# EasyEDA schematic SCH_RPi5-GPIO-Breakout-Board-(AI-Capsule)_2026-08-20.json

## Sheets
1 SCH_Breakout Board (ReSpeaker): TITLE: Sheet_1; REV: 1.0; Date: 2026-06-11; Sheet: 1/1; Drawn By: stevenkeates; Company: Your Company
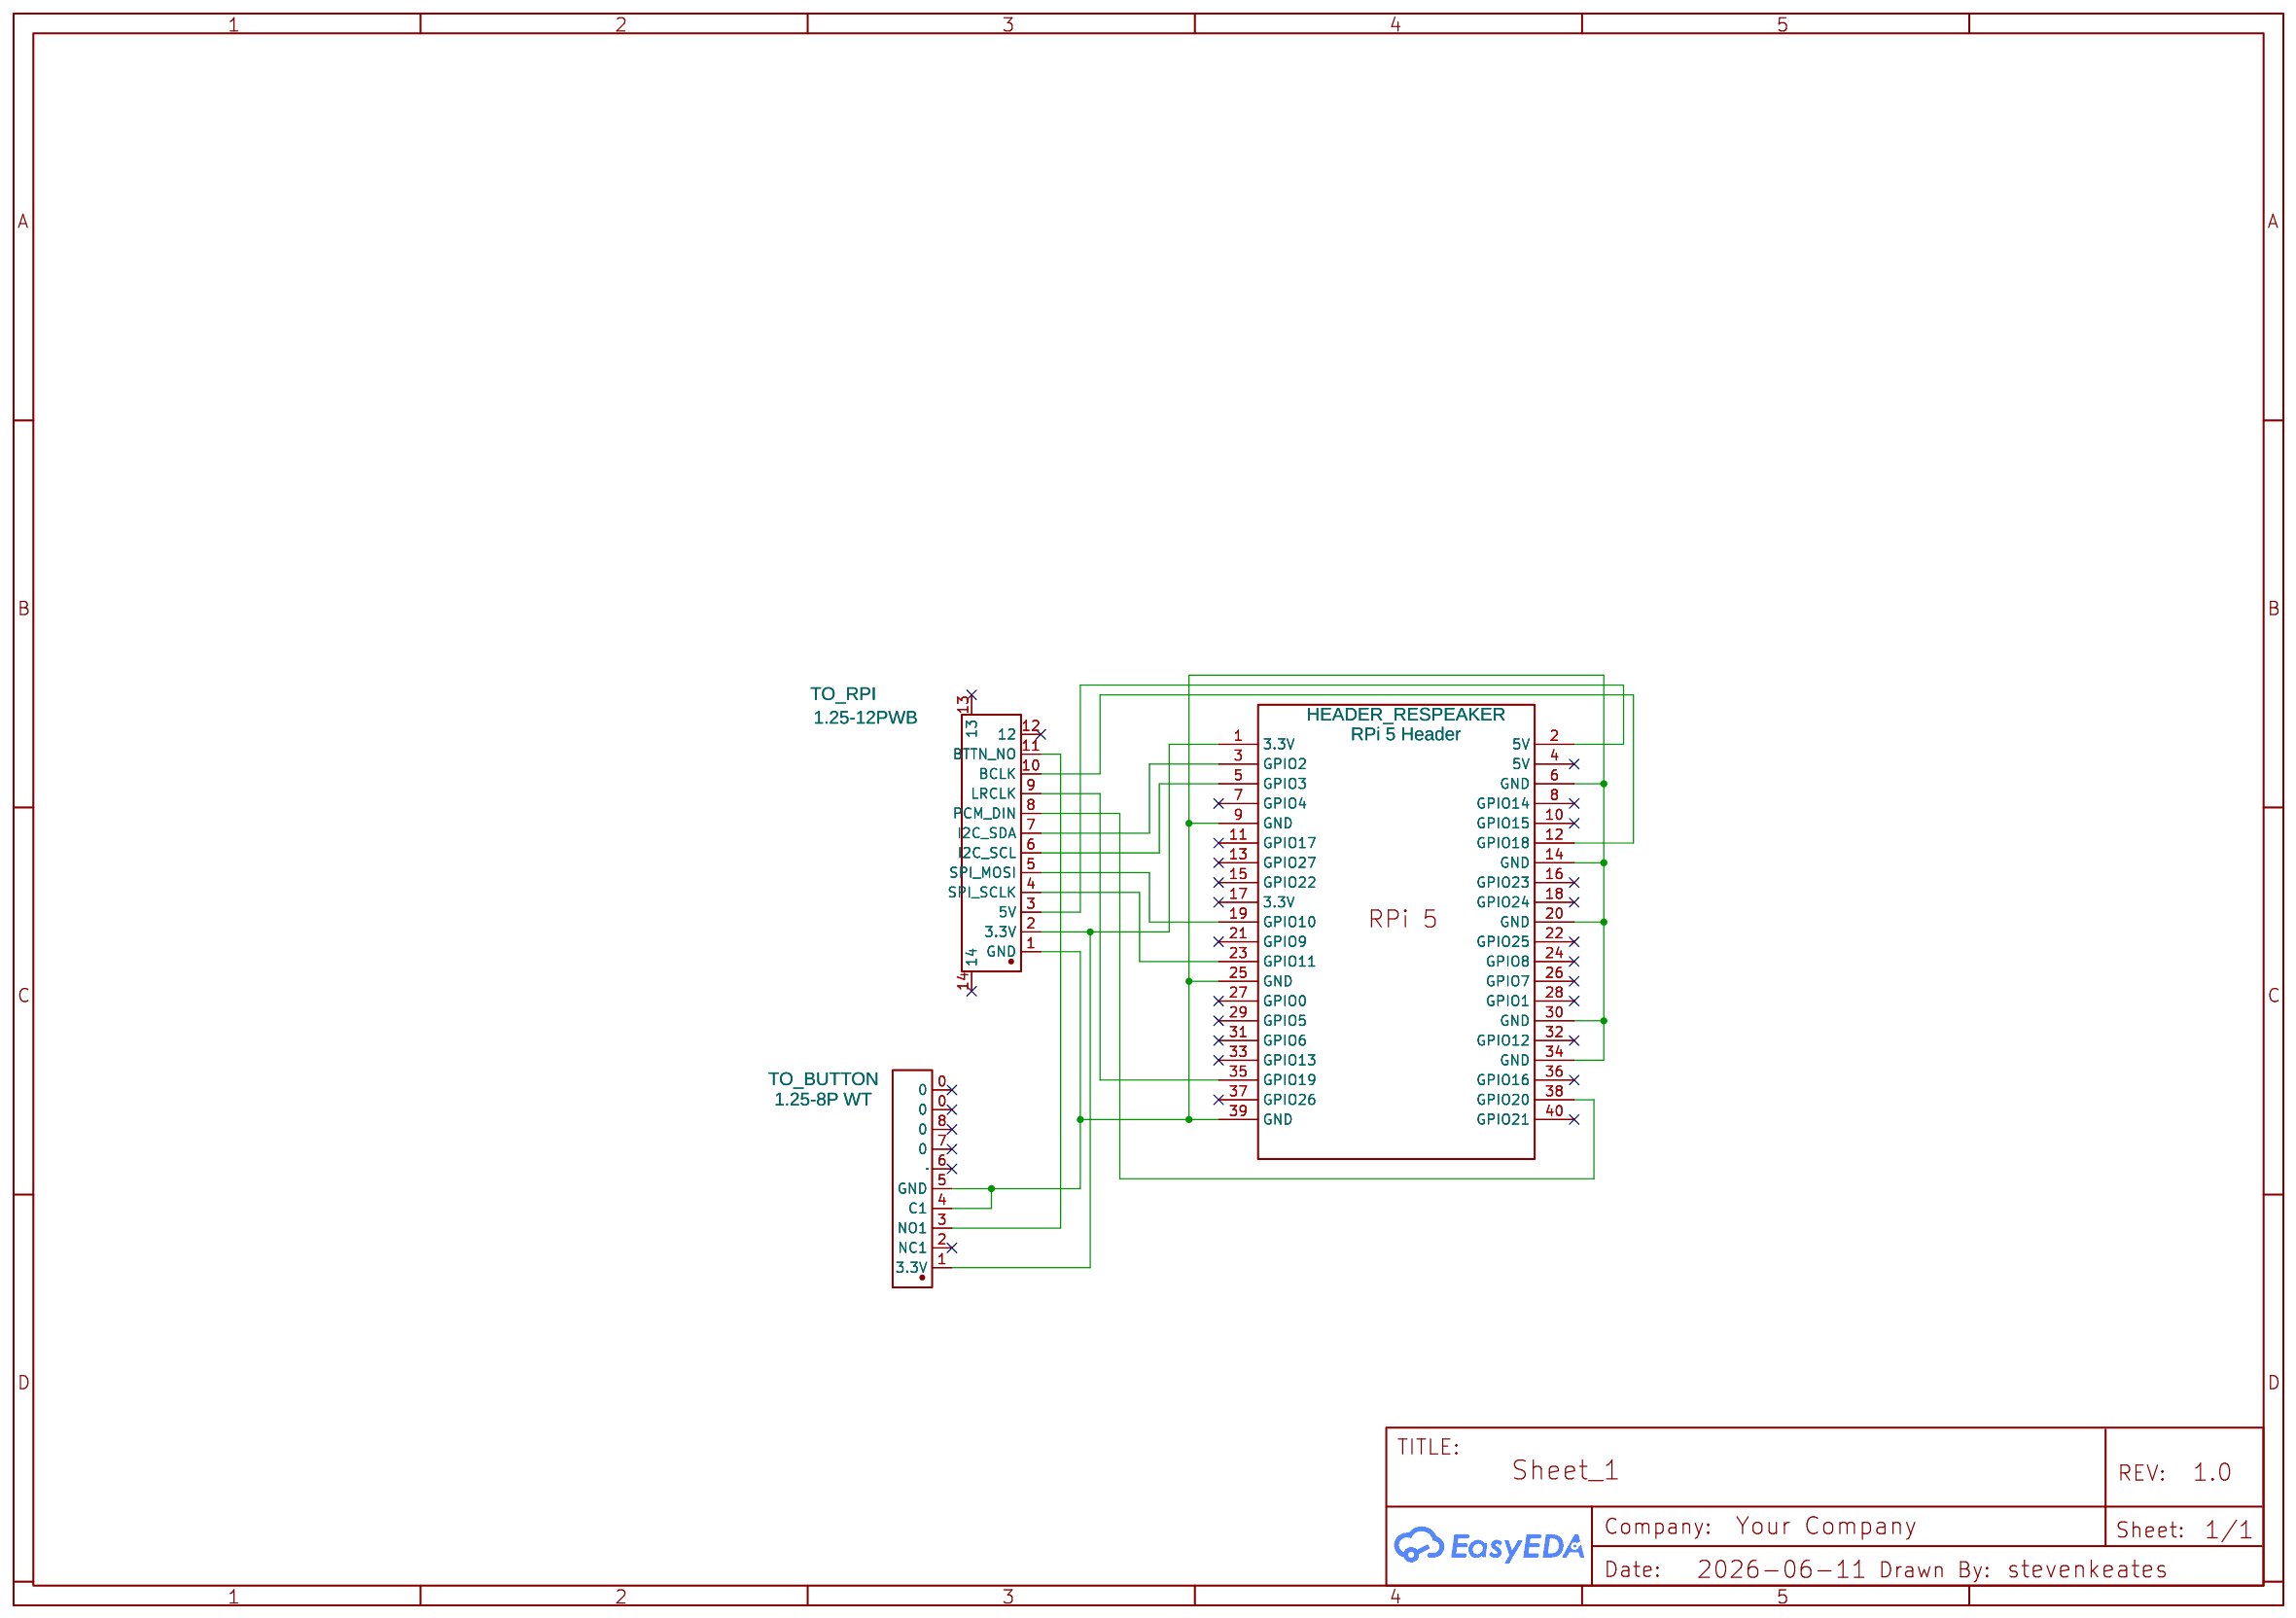
[diagram p0: SCH_Breakout Board (ReSpeaker)]
2 SCH_Breakout Board (RPi 5): TITLE: Rasberry Pi Breakout Board; REV: 2.0; Date: 2026-06-15; Company: Steven Keates
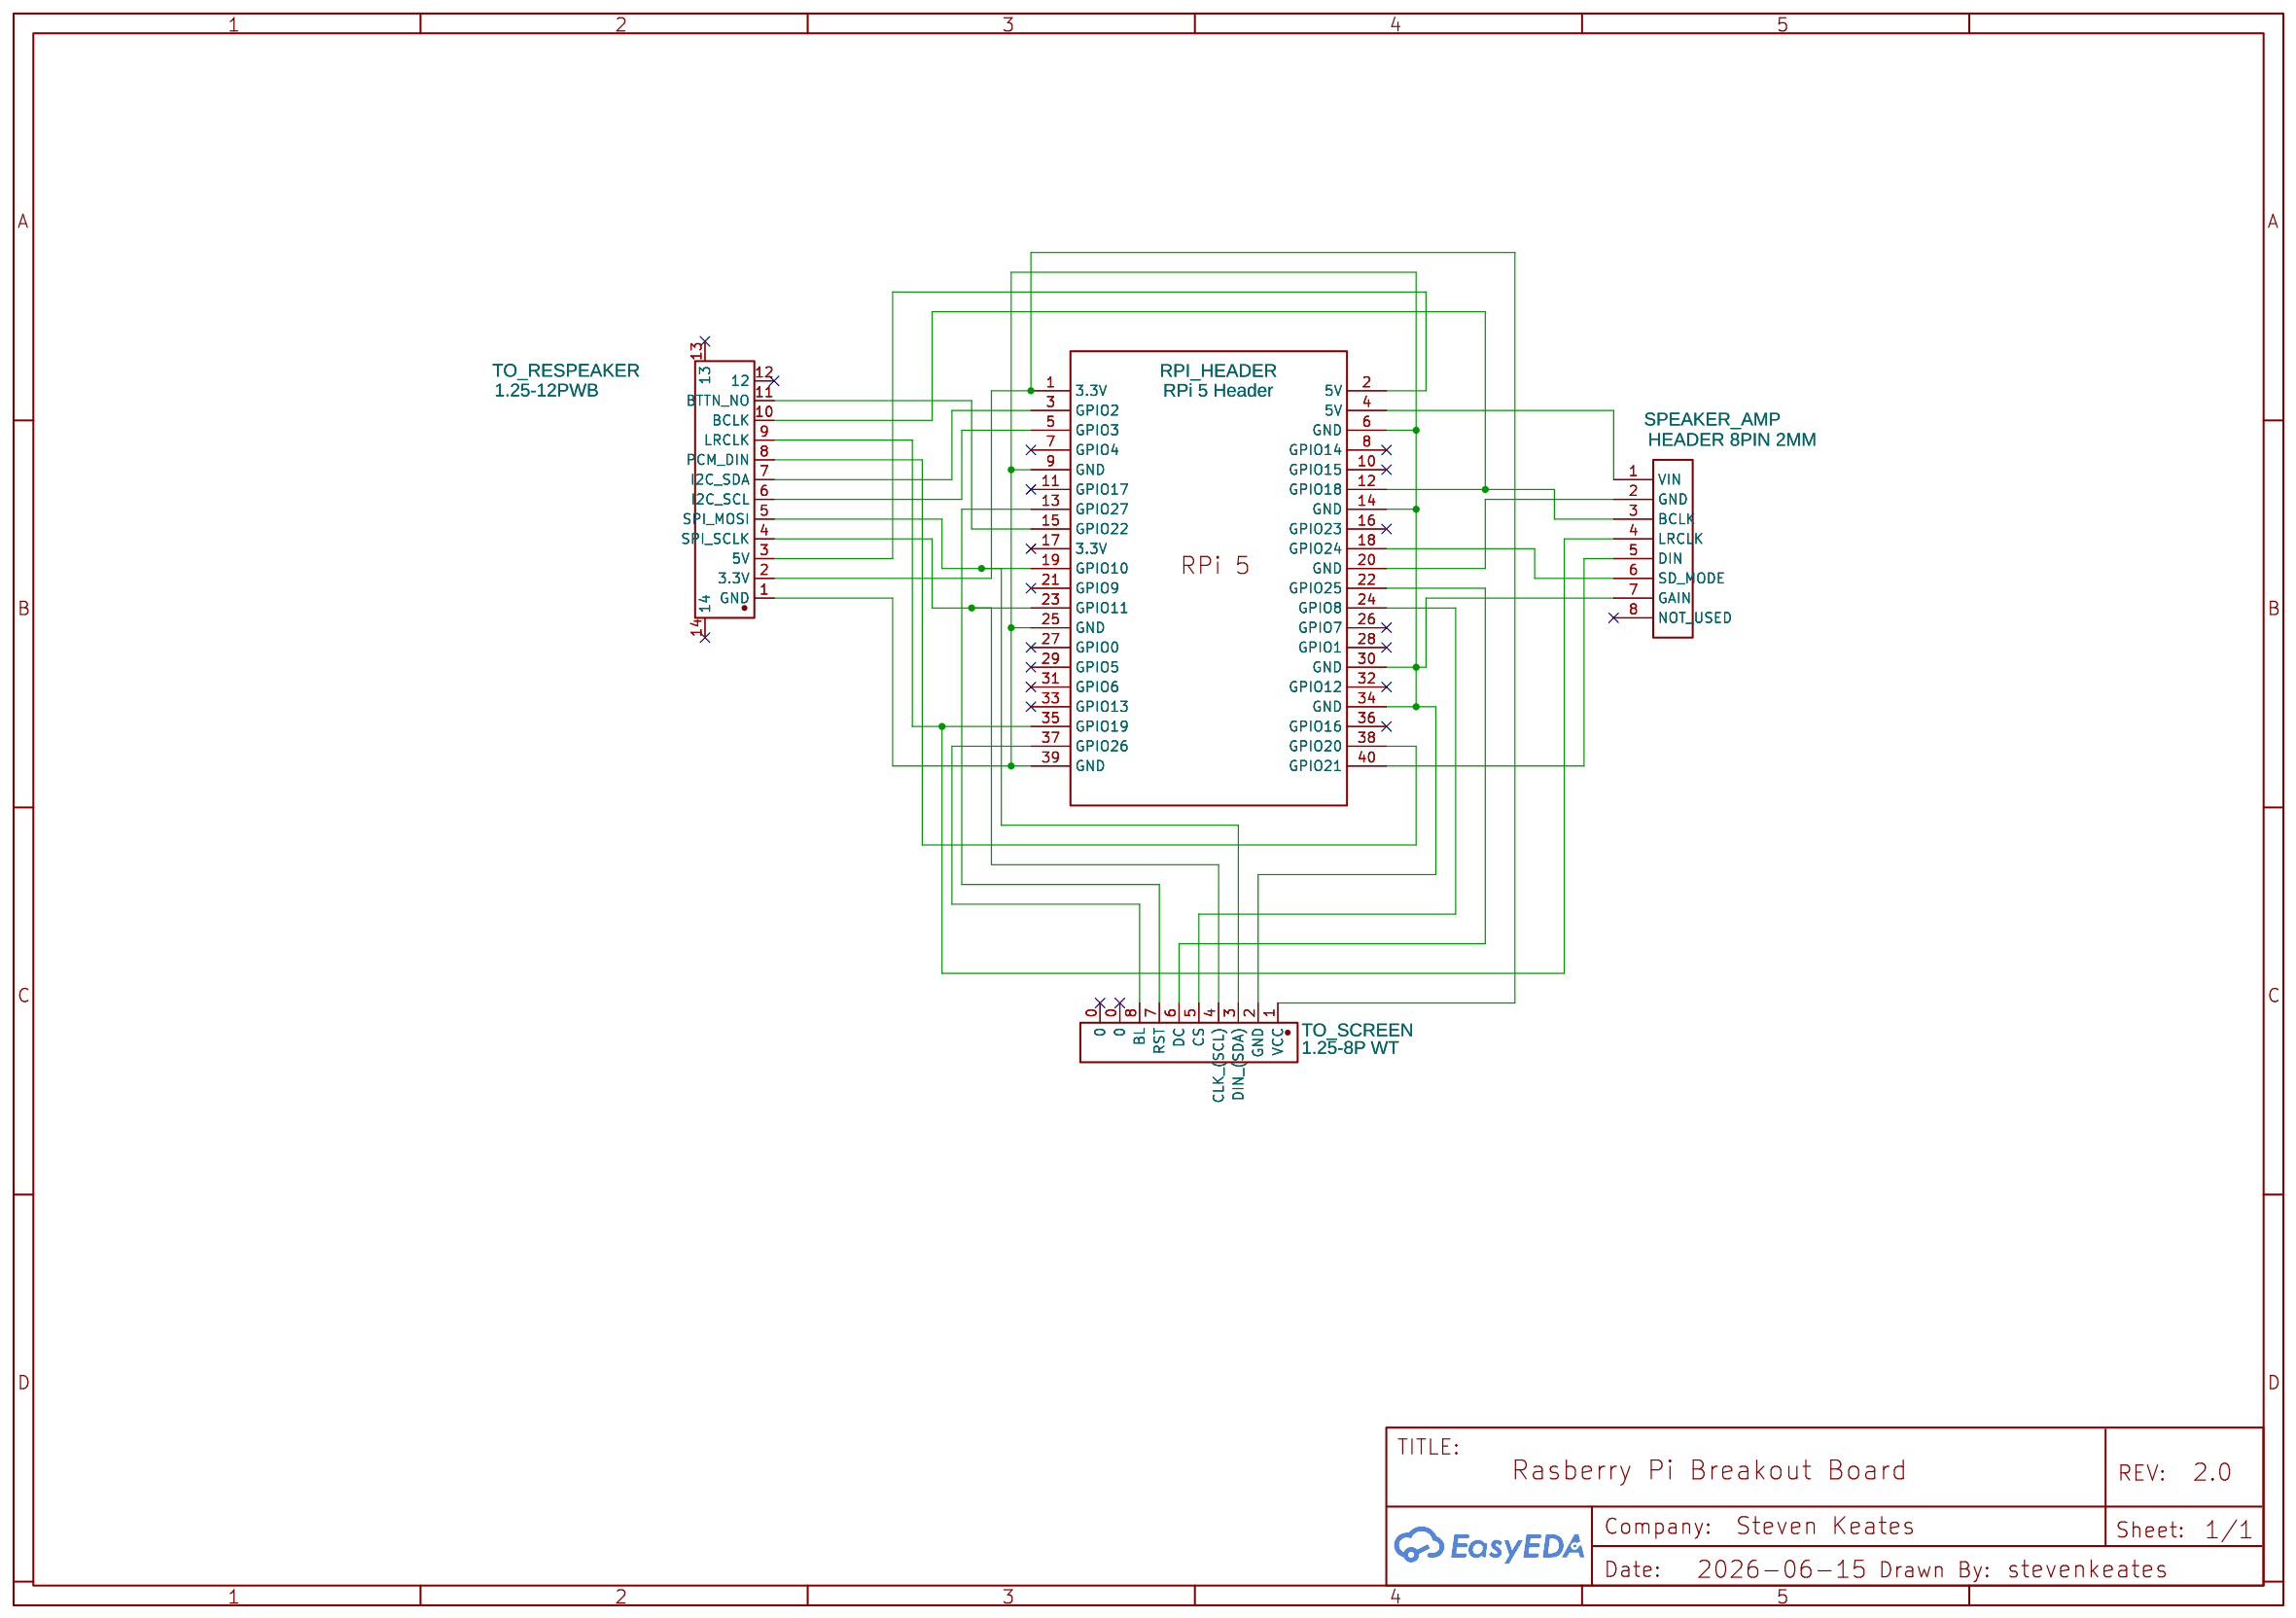
[diagram p1: SCH_Breakout Board (RPi 5)]

## Parts
sheet SCH_Breakout Board (ReSpeaker)
HEADER_RESPEAKER  RPi 5 Header  [HDR-20X2/2.54]
TO_BUTTON  1.25-8P WT  [CONN-SMD_8P-P1.25-L4.4-W14.8]
TO_RPI  1.25-12PWB  [CONN-SMD_12P-P1.25_DEALOON_1.25-12PWB]
sheet SCH_Breakout Board (RPi 5)
RPI_HEADER  RPi 5 Header  [HDR-20X2/2.54]
SPEAKER_AMP  HEADER 8PIN 2MM  [HEADER 8PIN 2MM]
TO_RESPEAKER  1.25-12PWB  [CONN-SMD_12P-P1.25_DEALOON_1.25-12PWB]
TO_SCREEN  1.25-8P WT  [CONN-SMD_8P-P1.25-L4.4-W14.8]

## Library data of the parts
HEADER_RESPEAKER RPI_HEADER = Raspberry Pi 5: Contributor: batinemiroglu; Manufacturer: Raspberry Pi 5 4GB
TO_BUTTON TO_SCREEN = 1.25-8P WT: Contributor: LCSC; Supplier: LCSC; Supplier Part: C2681529; Manufacturer: SHOU HAN(首韩); JLCPCB Part Class: Extended Part
TO_RESPEAKER TO_RPI = 1.25-12PWB: Contributor: lcsc; Supplier: LCSC; Supplier Part: C5140429; Manufacturer: DEALON(德艺隆); JLCPCB Part Class: Extended Part
SPEAKER_AMP = HEADER 8PIN 2MM: Contributor: Juxpom

## Nets
Net-(HEADER_RESPEAKER-1): HEADER_RESPEAKER.1(3.3V) TO_BUTTON.1(3.3V) TO_RPI.2(3.3V)
Net-(HEADER_RESPEAKER-2): HEADER_RESPEAKER.2(5V) TO_RPI.3(5V)
Net-(HEADER_RESPEAKER-3): HEADER_RESPEAKER.3(GPIO2) TO_RPI.7(I2C SDA)
Net-(HEADER_RESPEAKER-5): HEADER_RESPEAKER.5(GPIO3) TO_RPI.6(I2C SCL)
Net-(HEADER_RESPEAKER-6): HEADER_RESPEAKER.6(GND) HEADER_RESPEAKER.9(GND) HEADER_RESPEAKER.14(GND) HEADER_RESPEAKER.20(GND) HEADER_RESPEAKER.25(GND) HEADER_RESPEAKER.30(GND) HEADER_RESPEAKER.34(GND) HEADER_RESPEAKER.39(GND) TO_BUTTON.4(C1) TO_BUTTON.5(GND) TO_RPI.1(GND)
Net-(HEADER_RESPEAKER-12): HEADER_RESPEAKER.12(GPIO18) TO_RPI.10(BCLK)
Net-(HEADER_RESPEAKER-19): HEADER_RESPEAKER.19(GPIO10) TO_RPI.5(SPI MOSI)
Net-(HEADER_RESPEAKER-23): HEADER_RESPEAKER.23(GPIO11) TO_RPI.4(SPI SCLK)
Net-(HEADER_RESPEAKER-35): HEADER_RESPEAKER.35(GPIO19) TO_RPI.9(LRCLK)
Net-(HEADER_RESPEAKER-38): HEADER_RESPEAKER.38(GPIO20) TO_RPI.8(PCM_DIN)
Net-(RPI_HEADER-1): RPI_HEADER.1(3.3V) TO_RESPEAKER.2(3.3V) TO_SCREEN.1(VCC)
Net-(RPI_HEADER-2): RPI_HEADER.2(5V) TO_RESPEAKER.3(5V)
Net-(RPI_HEADER-3): RPI_HEADER.3(GPIO2) TO_RESPEAKER.7(I2C SDA)
Net-(RPI_HEADER-4): RPI_HEADER.4(5V) SPEAKER_AMP.1(VIN)
Net-(RPI_HEADER-5): RPI_HEADER.5(GPIO3) TO_RESPEAKER.6(I2C SCL)
Net-(RPI_HEADER-6): RPI_HEADER.6(GND) RPI_HEADER.9(GND) RPI_HEADER.14(GND) RPI_HEADER.25(GND) RPI_HEADER.30(GND) RPI_HEADER.34(GND) RPI_HEADER.39(GND) SPEAKER_AMP.7(GAIN) TO_RESPEAKER.1(GND) TO_SCREEN.2(GND)
Net-(RPI_HEADER-12): RPI_HEADER.12(GPIO18) SPEAKER_AMP.3(BCLK) TO_RESPEAKER.10(BCLK)
Net-(RPI_HEADER-13): RPI_HEADER.13(GPIO27) TO_SCREEN.7(RST)
Net-(RPI_HEADER-15): RPI_HEADER.15(GPIO22) TO_RESPEAKER.11(BTTN_NO)
Net-(RPI_HEADER-18): RPI_HEADER.18(GPIO24) SPEAKER_AMP.6(SD_MODE)
Net-(RPI_HEADER-19): RPI_HEADER.19(GPIO10) TO_RESPEAKER.5(SPI MOSI) TO_SCREEN.3(DIN (SDA))
Net-(RPI_HEADER-20): RPI_HEADER.20(GND) SPEAKER_AMP.2(GND)
Net-(RPI_HEADER-22): RPI_HEADER.22(GPIO25) TO_SCREEN.6(DC)
Net-(RPI_HEADER-23): RPI_HEADER.23(GPIO11) TO_RESPEAKER.4(SPI SCLK) TO_SCREEN.4(CLK (SCL))
Net-(RPI_HEADER-24): RPI_HEADER.24(GPIO8) TO_SCREEN.5(CS)
Net-(RPI_HEADER-35): RPI_HEADER.35(GPIO19) SPEAKER_AMP.4(LRCLK) TO_RESPEAKER.9(LRCLK)
Net-(RPI_HEADER-37): RPI_HEADER.37(GPIO26) TO_SCREEN.8(BL)
Net-(RPI_HEADER-38): RPI_HEADER.38(GPIO20) TO_RESPEAKER.8(PCM_DIN)
Net-(RPI_HEADER-40): RPI_HEADER.40(GPIO21) SPEAKER_AMP.5(DIN)
Net-(TO_BUTTON-3): TO_BUTTON.3(NO1) TO_RPI.11(BTTN_NO)

Not connected (* = marked no-connect by the designer): HEADER_RESPEAKER 4(5V)* 7(GPIO4)* 8(GPIO14)* 10(GPIO15)* 11(GPIO17)* 13(GPIO27)* 15(GPIO22)* 16(GPIO23)* 17(3.3V)* 18(GPIO24)* 21(GPIO9)* 22(GPIO25)* 24(GPIO8)* 26(GPIO7)* 27(GPIO0)* 28(GPIO1)* 29(GPIO5)* 31(GPIO6)* 32(GPIO12)* 33(GPIO13)* 36(GPIO16)* 37(GPIO26)* 40(GPIO21)*; RPI_HEADER 7(GPIO4)* 8(GPIO14)* 10(GPIO15)* 11(GPIO17)* 16(GPIO23)* 17(3.3V)* 21(GPIO9)* 26(GPIO7)* 27(GPIO0)* 28(GPIO1)* 29(GPIO5)* 31(GPIO6)* 32(GPIO12)* 33(GPIO13)* 36(GPIO16)*; SPEAKER_AMP 8(NOT_USED)*; TO_BUTTON 0* 2(NC1)* 6(DC)* 7(0)* 8(0)*; TO_RESPEAKER 12* 13* 14*; TO_RPI 12* 13* 14*; TO_SCREEN 0*
